# Altium schematic sheet FPGA.SchDoc
size 393 x 281 mm; PageSetup: Record=PageOptions|CenterHorizontal=True|CenterVertical=True|PrintScale=0.94|XCorrection=0.00|YCorrection=0.00|PrintKind=0|BorderSize=5000000|LeftOffset=0|BottomOffset=0|Orientation=2|PaperLength=1000|PaperWidth=1000|Scale=100|PaperSource=15|PrintQuality=600|MediaType=1|DitherType=10|PrintScaleMode=1|PaperKind=A4; Adr1: August Barks gata 6B; Adr2: SE-421 32 Västra Frölunda; Adr3: Sweden; Webpage: www.omnisys.se
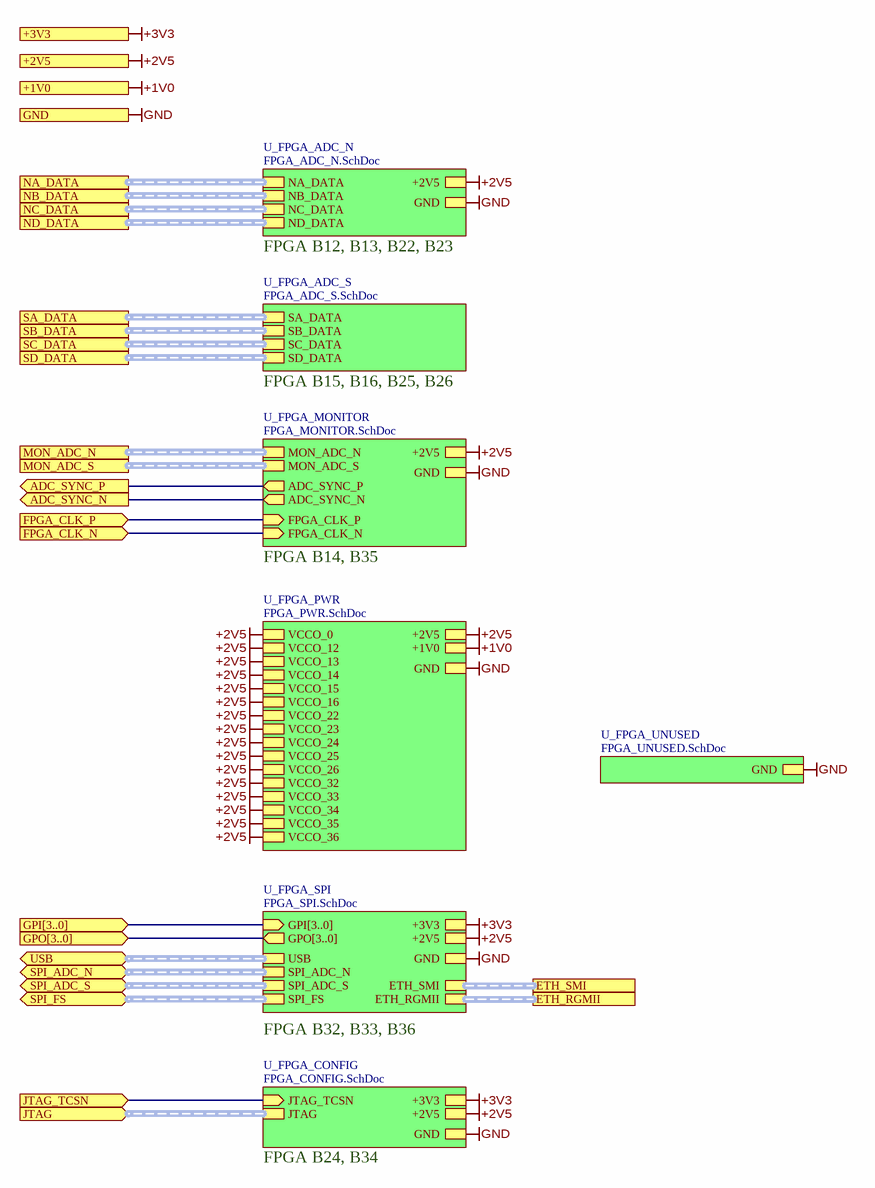
[diagram p0: FPGA.SchDoc]

## Sub-sheets
U_FPGA_ADC_N = FPGA_ADC_N.SchDoc: NA_DATA (harness ADC Port), NC_DATA (harness ADC Port), ND_DATA (harness ADC Port), NB_DATA (harness ADC Port), GND, +2V5
U_FPGA_ADC_S = FPGA_ADC_S.SchDoc: SA_DATA (harness ADC Port), SC_DATA (harness ADC Port), SD_DATA (harness ADC Port), SB_DATA (harness ADC Port)
U_FPGA_CONFIG = FPGA_CONFIG.SchDoc: JTAG_TCSN (in), JTAG (harness USB JTAG), GND, +2V5, +3V3
U_FPGA_MONITOR = FPGA_MONITOR.SchDoc: MON_ADC_N (harness MON_ADC), MON_ADC_S (harness MON_ADC), FPGA_CLK_P (in), FPGA_CLK_N (in), ADC_SYNC_P (out), ADC_SYNC_N (out), +2V5, GND
U_FPGA_PWR = FPGA_PWR.SchDoc: VCCO_36, +2V5, VCCO_12, VCCO_13, VCCO_14, VCCO_15, VCCO_16, VCCO_22, VCCO_23, VCCO_24, VCCO_25, VCCO_26, VCCO_32, VCCO_33, VCCO_34, VCCO_35, +1V0, GND, VCCO_0
U_FPGA_SPI = FPGA_SPI.SchDoc: USB (harness USB FIFO), SPI_ADC_N (harness SPI_ADC), SPI_ADC_S (harness SPI_ADC), SPI_FS (harness SPI_FS), GPI[3..0] (in), +3V3, GND, +2V5, ETH_SMI (harness ETH_SMI), ETH_RGMII (harness ETH_RGMII), GPO[3..0] (out)
U_FPGA_UNUSED = FPGA_UNUSED.SchDoc: GND

## Ports
+1V0, +2V5, +3V3, ADC_SYNC_N (out), ADC_SYNC_P (out), ETH_RGMII (harness ETH_RGMII), ETH_SMI (harness ETH_SMI), FPGA_CLK_N (in), FPGA_CLK_P (in), GND, GPI[3..0] (in), GPO[3..0] (in), JTAG (in, harness USB JTAG), JTAG_TCSN (in), MON_ADC_N (harness MON_ADC), MON_ADC_S (harness MON_ADC), NA_DATA (harness ADC Port), NB_DATA (harness ADC Port), NC_DATA (harness ADC Port), ND_DATA (harness ADC Port), SA_DATA (harness ADC Port), SB_DATA (harness ADC Port), SC_DATA (harness ADC Port), SD_DATA (harness ADC Port), SPI_ADC_N (bidir, harness SPI_ADC), SPI_ADC_S (bidir, harness SPI_ADC), SPI_FS (bidir, harness SPI_FS), USB (bidir, harness USB FIFO)

## Nets
+1V0: port +1V0, sheet U_FPGA_PWR/+1V0
+2V5: port +2V5, sheet U_FPGA_PWR/VCCO_36, sheet U_FPGA_PWR/+2V5, sheet U_FPGA_PWR/VCCO_12, sheet U_FPGA_PWR/VCCO_13, sheet U_FPGA_PWR/VCCO_14, sheet U_FPGA_PWR/VCCO_15, sheet U_FPGA_PWR/VCCO_16, sheet U_FPGA_PWR/VCCO_22, sheet U_FPGA_PWR/VCCO_23, sheet U_FPGA_PWR/VCCO_24, sheet U_FPGA_PWR/VCCO_25, sheet U_FPGA_PWR/VCCO_26, sheet U_FPGA_PWR/VCCO_32, sheet U_FPGA_PWR/VCCO_33, sheet U_FPGA_PWR/VCCO_34, sheet U_FPGA_PWR/VCCO_35, sheet U_FPGA_PWR/VCCO_0, sheet U_FPGA_ADC_N/+2V5, sheet U_FPGA_SPI/+2V5, sheet U_FPGA_MONITOR/+2V5, sheet U_FPGA_CONFIG/+2V5
+3V3: port +3V3, sheet U_FPGA_SPI/+3V3, sheet U_FPGA_CONFIG/+3V3
GND: port GND, sheet U_FPGA_PWR/GND, sheet U_FPGA_ADC_N/GND, sheet U_FPGA_SPI/GND, sheet U_FPGA_MONITOR/GND, sheet U_FPGA_UNUSED/GND, sheet U_FPGA_CONFIG/GND
ADC_SYNC_N: port ADC_SYNC_N, sheet U_FPGA_MONITOR/ADC_SYNC_N
ADC_SYNC_P: port ADC_SYNC_P, sheet U_FPGA_MONITOR/ADC_SYNC_P
FPGA_CLK_N: port FPGA_CLK_N, sheet U_FPGA_MONITOR/FPGA_CLK_N
FPGA_CLK_P: port FPGA_CLK_P, sheet U_FPGA_MONITOR/FPGA_CLK_P
JTAG_TCSN: port JTAG_TCSN, sheet U_FPGA_CONFIG/JTAG_TCSN

## Buses and harness runs
bus port GPI[3..0] = sheet U_FPGA_SPI/GPI[3..0]
bus port GPO[3..0] = sheet U_FPGA_SPI/GPO[3..0]
harness port ETH_RGMII = sheet U_FPGA_SPI/ETH_RGMII
harness port ETH_SMI = sheet U_FPGA_SPI/ETH_SMI
harness port JTAG = sheet U_FPGA_CONFIG/JTAG
harness port MON_ADC_N = sheet U_FPGA_MONITOR/MON_ADC_N
harness port MON_ADC_S = sheet U_FPGA_MONITOR/MON_ADC_S
harness port NA_DATA = sheet U_FPGA_ADC_N/NA_DATA
harness port NB_DATA = sheet U_FPGA_ADC_N/NB_DATA
harness port NC_DATA = sheet U_FPGA_ADC_N/NC_DATA
harness port ND_DATA = sheet U_FPGA_ADC_N/ND_DATA
harness port SA_DATA = sheet U_FPGA_ADC_S/SA_DATA
harness port SB_DATA = sheet U_FPGA_ADC_S/SB_DATA
harness port SC_DATA = sheet U_FPGA_ADC_S/SC_DATA
harness port SD_DATA = sheet U_FPGA_ADC_S/SD_DATA
harness port SPI_ADC_N = sheet U_FPGA_SPI/SPI_ADC_N
harness port SPI_ADC_S = sheet U_FPGA_SPI/SPI_ADC_S
harness port SPI_FS = sheet U_FPGA_SPI/SPI_FS
harness port USB = sheet U_FPGA_SPI/USB

## Notes on the sheet
- FPGA B12, B13, B22, B23
- FPGA B15, B16, B25, B26
- FPGA B14, B35
- FPGA B32, B33, B36
- FPGA B24, B34
- Title:
- SVN:
- August Barks gata 6B
- SE-421 32 Västra Frölunda
- Omnisys Instruments AB
- PCB ASY:
- PCB:
- SVN Folder:
- www.omnisys.se
- Page:
- of
- Print date:
- Page size:
- A3
- Information contained in this drawing is confidential. Copying, distributing or use in any matter, other than that specified by OMNISYS INSTRUMENTS AB, is strictly prohibited.